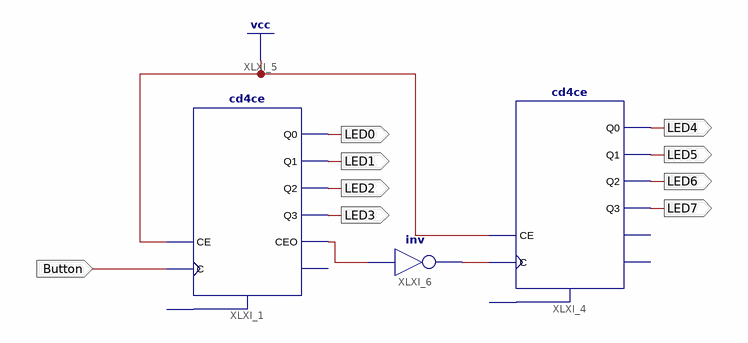
[diagram p0: schematic sheet 1]
// Xilinx ISE schematic Test.sch (spartan6) as structural Verilog: 3 symbols, 9 ports
module Test (
  input  Button,
  output LED0,
  output LED1,
  output LED2,
  output LED3,
  output LED4,
  output LED5,
  output LED6,
  output LED7
);

  wire XLXN_1, XLXN_13;

  cd4ce XLXI_1 (.C(Button), .CE(1'b1), .CEO(XLXN_1), .Q0(LED0), .Q1(LED1), .Q2(LED2), .Q3(LED3));  // open: CLR, TC
  cd4ce XLXI_4 (.C(XLXN_13), .CE(1'b1), .Q0(LED4), .Q1(LED5), .Q2(LED6), .Q3(LED7));  // open: CLR, CEO, TC
  not XLXI_6 (XLXN_13, XLXN_1);

  // Notes on the sheet:
  //   CLOCK_DEDICATED_ROUTE on signal Button = FALSE
endmodule
